# Altium project Dash.PrjPCB
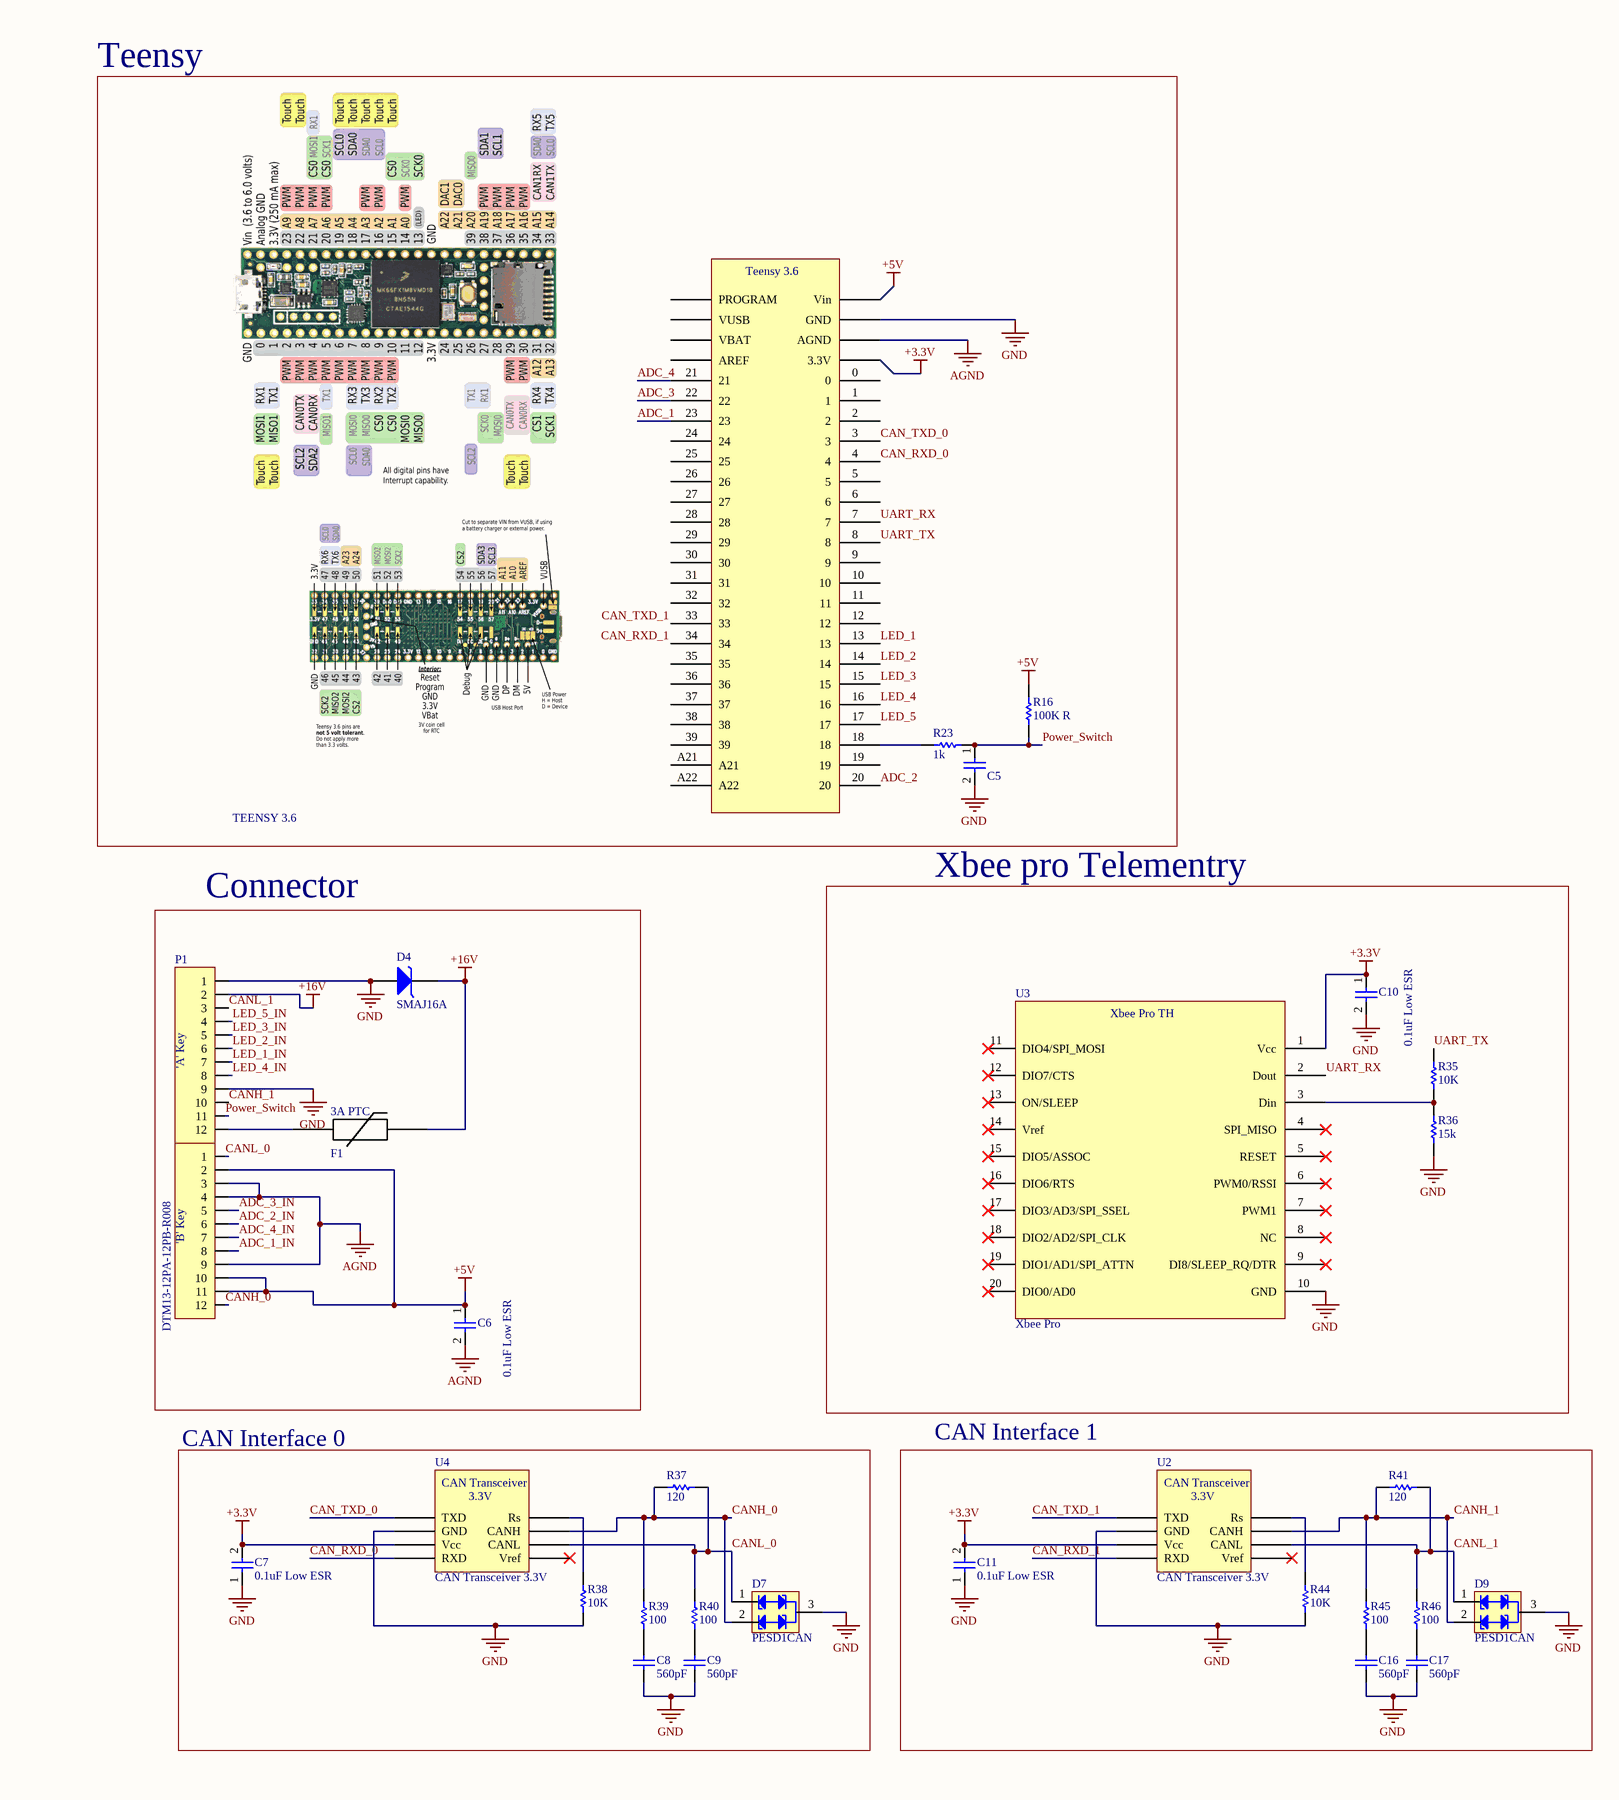
[diagram p0: Dash.SchDoc, left]
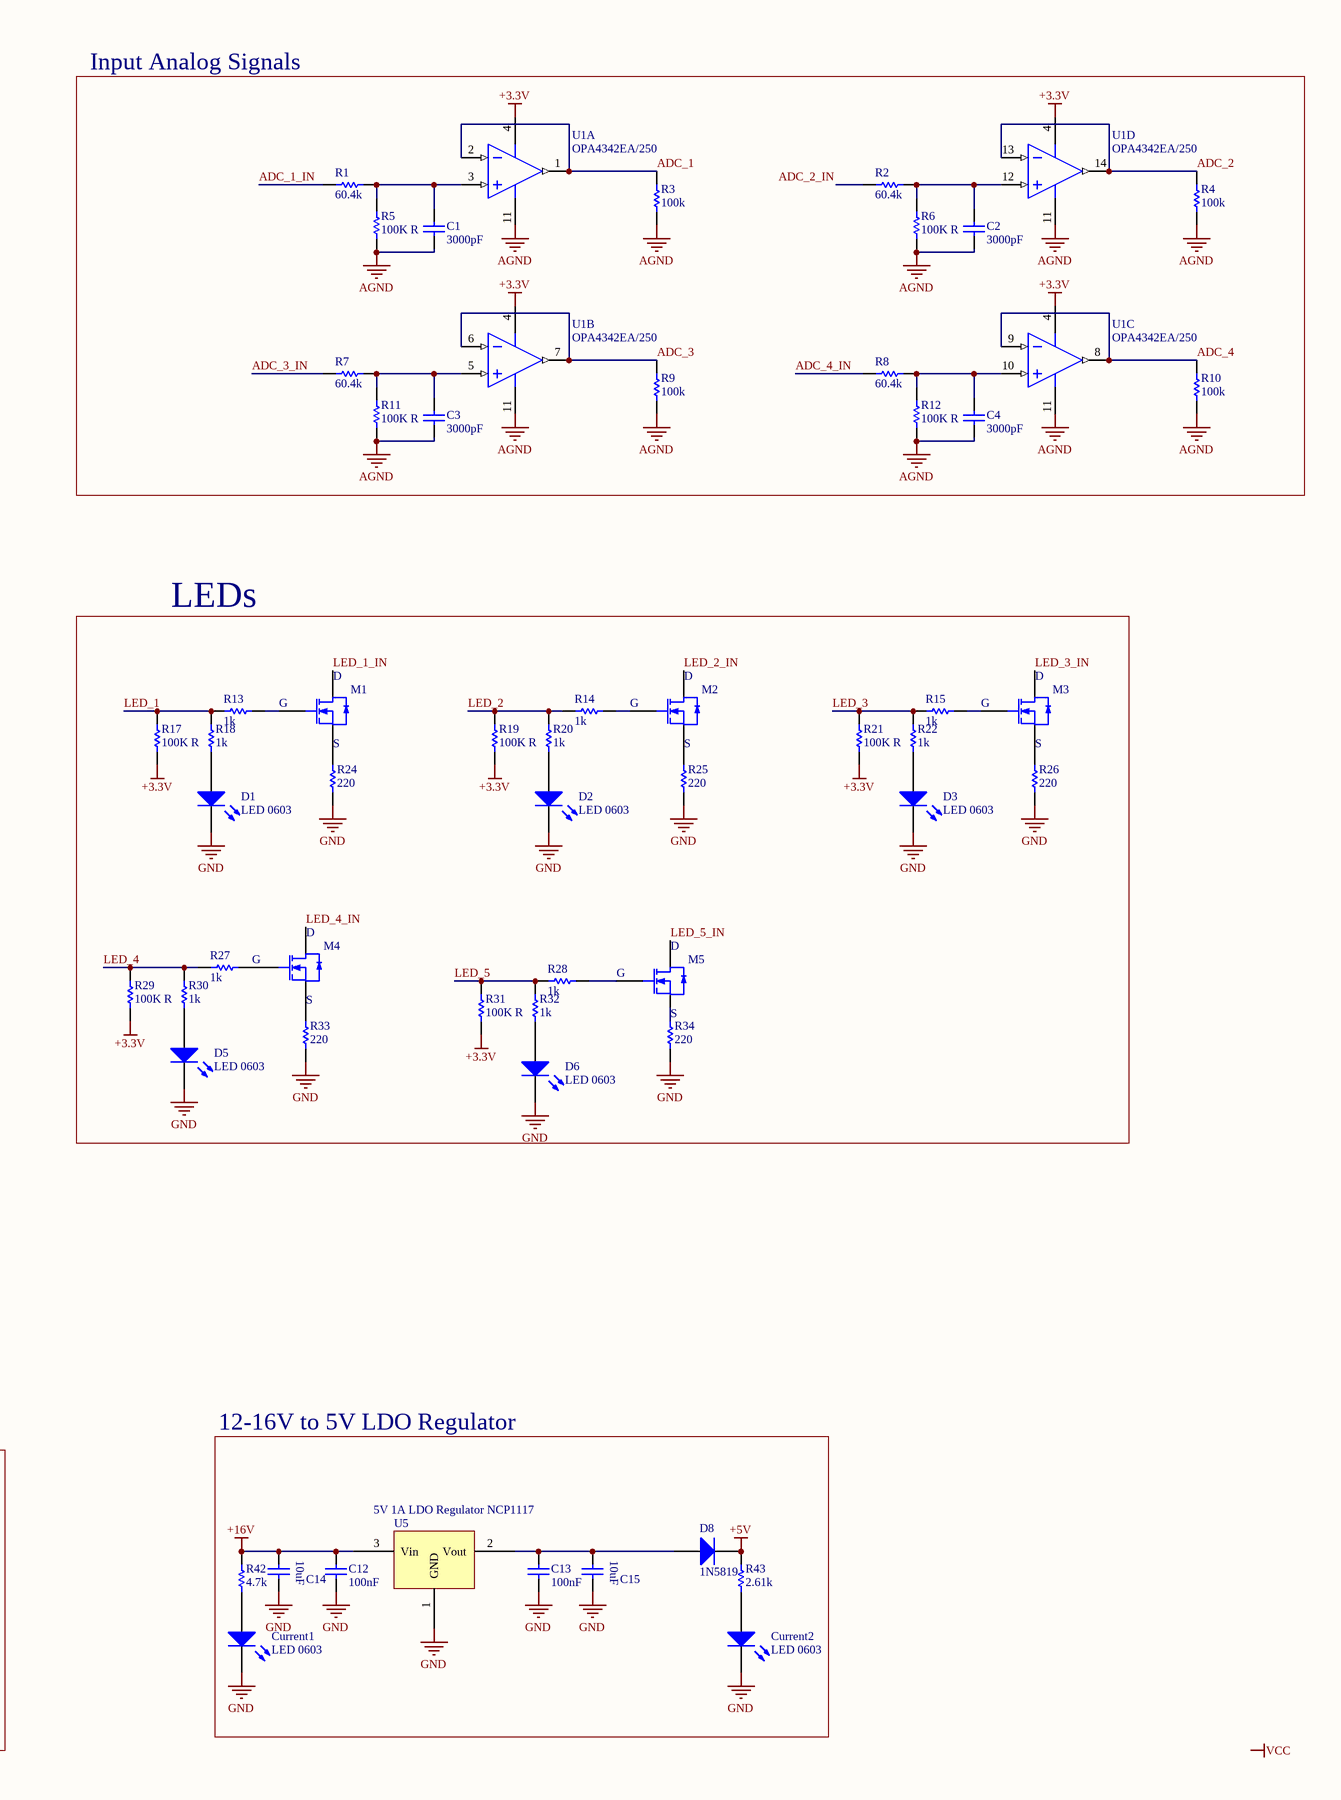
[diagram p1: Dash.SchDoc, right]
1 sheet, 87 parts. Net scope: global (net labels, ports and power ports of the same name join across sheets).
Board file: Dash.PcbDoc

## Sheet Dash.SchDoc
size A2

### Parts
C1  Capacitance: 3000pF  [J1-0603]  (hidden comment: C 3000pF)
C2  Capacitance: 3000pF  [J1-0603]  (hidden comment: C 3000pF)
C3  Capacitance: 3000pF  [J1-0603]  (hidden comment: C 3000pF)
C4  Capacitance: 3000pF  [J1-0603]  (hidden comment: C 3000pF)
C5  0.1uF Low ESR  [J1-0603]  (value not drawn)
C6  0.1uF Low ESR  [J1-0603]
C7  0.1uF Low ESR  [J1-0603]
C8  Capacitance: 560pF  [C0805]  (hidden comment: C 560pF)
C9  Capacitance: 560pF  [C0805]  (hidden comment: C 560pF)
C10  0.1uF Low ESR  [J1-0603]
C11  0.1uF Low ESR  [J1-0603]
C12  Capacitance: 100nF  [J1-0603]  (hidden comment: 0.1uF 0603)
C13  Capacitance: 100nF  [J1-0603]  (hidden comment: 0.1uF 0603)
C14  C 10uF 25V 0805  [C0805]  (value not drawn)
C15  C 10uF 25V 0805  [C0805]  (value not drawn)
C16  Capacitance: 560pF  [C0805]  (hidden comment: C 560pF)
C17  Capacitance: 560pF  [C0805]  (hidden comment: C 560pF)
Current1  LED 0603  [J1-0603 LED]
Current2  LED 0603  [J1-0603 LED]
D1  LED 0603  [J1-0603 LED]
D2  LED 0603  [J1-0603 LED]
D3  LED 0603  [J1-0603 LED]
D4  SMAJ16A  [DO-214AC]
D5  LED 0603  [J1-0603 LED]
D6  LED 0603  [J1-0603 LED]
D7  PESD1CAN  [SOT323(SC-70)]
D8  1N5819  [SOD123]
D9  PESD1CAN  [SOT323(SC-70)]
F1  PTC RESET FUSE 24V 3A 2920  [2920 (7351 Metric)]  (value not drawn)
M1  Mosfet N-Channel 3.3V Switch  [SOT23_N]  (value not drawn)
M2  Mosfet N-Channel 3.3V Switch  [SOT23_N]  (value not drawn)
M3  Mosfet N-Channel 3.3V Switch  [SOT23_N]  (value not drawn)
M4  Mosfet N-Channel 3.3V Switch  [SOT23_N]  (value not drawn)
M5  Mosfet N-Channel 3.3V Switch  [SOT23_N]  (value not drawn)
P1  DTM13-12PA-12PB-R008  [DTM13-12PA-12PB-R008]
R1  Resistance (Ohms): 60.4k  [J1-0603]  (hidden comment: 60.4K R)
R2  Resistance (Ohms): 60.4k  [J1-0603]  (hidden comment: 60.4K R)
R3  Resistance (Ohms): 100k  [J1-0603]  (hidden comment: 100K R)
R4  Resistance (Ohms): 100k  [J1-0603]  (hidden comment: 100K R)
R5  100K R  [J1-0603]
R6  100K R  [J1-0603]
R7  Resistance (Ohms): 60.4k  [J1-0603]  (hidden comment: 60.4K R)
R8  Resistance (Ohms): 60.4k  [J1-0603]  (hidden comment: 60.4K R)
R9  Resistance (Ohms): 100k  [J1-0603]  (hidden comment: 100K R)
R10  Resistance (Ohms): 100k  [J1-0603]  (hidden comment: 100K R)
R11  100K R  [J1-0603]
R12  100K R  [J1-0603]
R13  Resistance (Ohms): 1k  [J1-0603]  (hidden comment: 1K R)
R14  Resistance (Ohms): 1k  [J1-0603]  (hidden comment: 1K R)
R15  Resistance (Ohms): 1k  [J1-0603]  (hidden comment: 1K R)
R16  100K R  [J1-0603]
R17  100K R  [J1-0603]
R18  Resistance (Ohms): 1k  [J1-0603]  (hidden comment: 1K R)
R19  100K R  [J1-0603]
R20  Resistance (Ohms): 1k  [J1-0603]  (hidden comment: 1K R)
R21  100K R  [J1-0603]
R22  Resistance (Ohms): 1k  [J1-0603]  (hidden comment: 1K R)
R23  Resistance (Ohms): 1k  [J1-0603]  (hidden comment: 1K R)
R24  Resistance (Ohms): 220  [J1-0603]  (hidden comment: 220 R)
R25  Resistance (Ohms): 220  [J1-0603]  (hidden comment: 220 R)
R26  Resistance (Ohms): 220  [J1-0603]  (hidden comment: 220 R)
R27  Resistance (Ohms): 1k  [J1-0603]  (hidden comment: 1K R)
R28  Resistance (Ohms): 1k  [J1-0603]  (hidden comment: 1K R)
R29  100K R  [J1-0603]
R30  Resistance (Ohms): 1k  [J1-0603]  (hidden comment: 1K R)
R31  100K R  [J1-0603]
R32  Resistance (Ohms): 1k  [J1-0603]  (hidden comment: 1K R)
R33  Resistance (Ohms): 220  [J1-0603]  (hidden comment: 220 R)
R34  Resistance (Ohms): 220  [J1-0603]  (hidden comment: 220 R)
R35  value 10K  [0603]  (hidden comment: 10K R)
R36  value 15k  [0603]  (hidden comment: 15K R)
R37  Resistance (Ohms): 120  [J1-0603]  (hidden comment: 120 R)
R38  value 10K  [J1-0603]  (hidden comment: 10K R)
R39  Resistance (Ohms): 100  [J1-0603]  (hidden comment: 100 R)
R40  Resistance (Ohms): 100  [J1-0603]  (hidden comment: 100 R)
R41  Resistance (Ohms): 120  [J1-0603]  (hidden comment: 120 R)
R42  Resistance (Ohms): 4.7k  [J1-0603]  (hidden comment: 4.7K R)
R43  Resistance (Ohms): 2.61k  [J1-0603]  (hidden comment: 2.61k R)
R44  value 10K  [J1-0603]  (hidden comment: 10K R)
R45  Resistance (Ohms): 100  [J1-0603]  (hidden comment: 100 R)
R46  Resistance (Ohms): 100  [J1-0603]  (hidden comment: 100 R)
TEENSY_3.6  Teensy 3.6  [Teensy 3.6]  (value not drawn)
U1  OPA4342EA/250  [TSSOP-14]  (parts A,B,C,D of 4)
U2  CAN Transceiver 3.3V  [8-SOIC]
U3  Xbee Pro  [Xbee Pro]
U4  CAN Transceiver 3.3V  [8-SOIC]
U5  5V 1A LDO Regulator NCP1117  [SOT-223]

### Blocks framed on the sheet
Teensy: C5 R16 R23 TEENSY_3.6
Input Analog Signals: C1-C4 R1-R12 U1
LEDs: D1-D3 D5 D6 M1-M5 R13-R15 R17-R22 R24-R34
Connector: C6 D4 F1 P1
Xbee pro Telementry: C10 R35 R36 U3
CAN Interface 0: C7-C9 D7 R37-R40 U4
CAN Interface 1: C11 C16 C17 D9 R41 R44-R46 U2
12-16V to 5V LDO Regulator: C12-C15 Current1 Current2 D8 R42 R43 U5

### Nets
+3.3V: C7.2 C10.1 C11.2 R17.2 R19.2 R21.2 R29.2 R31.2 TEENSY_3.6.3.3V U1.4(V+) U2.3(Vcc) U3.1(Vcc) U4.3(Vcc)
+5V: C6.1 D8.1 P1.14(2) P1.22(10) P1.23(11) R16.1 R43.1 TEENSY_3.6.VIN(Vin)
+16V: C12.2 C14.1 D4.1(K) F1.1 P1.2 R42.1 U5.3(Vin)
AGND: C1.2 C2.2 C3.2 C4.2 C6.2 P1.15(3) P1.16(4) P1.21(9) R3.1 R4.1 R5.2 R6.2 R9.1 R10.1 R11.2 R12.2 TEENSY_3.6.AGND U1.11(V-)
GND: C5.2 C7.1 C8.1 C9.1 C10.2 C11.1 C12.1 C13.1 C14.2 C15.2 C16.1 C17.1 Current1.2(K) Current2.2(K) D1.2(K) D2.2(K) D3.2(K) D4.2(A) D5.2(K) D6.2(K) D7.3 D9.3 P1.1 P1.9 R24.2 R25.2 R26.2 R33.2 R34.2 R36.1 R38.1 R44.1 TEENSY_3.6.GND U2.2(GND) U3.10(GND) U4.2(GND) U5.1(GND)
ADC_1: R3.2 TEENSY_3.6.23 U1.1(OUT_A) U1.2(IN_A-)
ADC_1_IN: P1.20(8) R1.1
ADC_2: R4.2 TEENSY_3.6.20 U1.13(IN_D-) U1.14(OUT_D)
ADC_2_IN: P1.18(6) R2.1
ADC_3: R9.2 TEENSY_3.6.22 U1.6(IN_B-) U1.7(OUT_B)
ADC_3_IN: P1.17(5) R7.1
ADC_4: R10.2 TEENSY_3.6.21 U1.8(OUT_C) U1.9(IN_C-)
ADC_4_IN: P1.19(7) R8.1
CAN_RXD_0: TEENSY_3.6.4 U4.4(RXD)
CAN_RXD_1: TEENSY_3.6.34 U2.4(RXD)
CAN_TXD_0: TEENSY_3.6.3 U4.1(TXD)
CAN_TXD_1: TEENSY_3.6.33 U2.1(TXD)
CANH_0: D7.2 P1.24(12) R37.1 R39.1 U4.7(CANH)
CANH_1: D9.2 P1.10 R41.1 R45.1 U2.7(CANH)
CANL_0: D7.1 P1.13(1) R37.2 R40.2 U4.6(CANL)
CANL_1: D9.1 P1.3 R41.2 R46.2 U2.6(CANL)
LED_1: R13.1 R17.1 R18.2 TEENSY_3.6.13
LED_1_IN: M1.1(D) P1.7
LED_2: R14.1 R19.1 R20.2 TEENSY_3.6.14
LED_2_IN: M2.1(D) P1.6
LED_3: R15.1 R21.1 R22.2 TEENSY_3.6.15
LED_3_IN: M3.1(D) P1.5
LED_4: R27.1 R29.1 R30.2 TEENSY_3.6.16
LED_4_IN: M4.1(D) P1.8
LED_5: R28.1 R31.1 R32.2 TEENSY_3.6.17
LED_5_IN: M5.1(D) P1.4
Power_Switch: C5.1 P1.11 R16.2 R23.2
UART_RX: TEENSY_3.6.7 U3.2(Dout)
UART_TX: R35.2 TEENSY_3.6.8
NetC1_1: C1.1 R1.2 R5.1 U1.3(IN_A+)
NetC2_1: C2.1 R2.2 R6.1 U1.12(IN_D+)
NetC3_1: C3.1 R7.2 R11.1 U1.5(IN_B+)
NetC4_1: C4.1 R8.2 R12.1 U1.10(IN_C+)
NetC8_2: C8.2 R39.2
NetC9_2: C9.2 R40.1
NetC13_2: C13.2 C15.1 D8.2 U5.2(Vout)
NetC16_2: C16.2 R45.2
NetC17_2: C17.2 R46.1
NetCurrent1_1: Current1.1(A) R42.2
NetCurrent2_1: Current2.1(A) R43.2
NetD1_1: D1.1(A) R18.1
NetD2_1: D2.1(A) R20.1
NetD3_1: D3.1(A) R22.1
NetD5_1: D5.1(A) R30.1
NetD6_1: D6.1(A) R32.1
NetF1_2: F1.2 P1.12
NetM1_2: M1.2(S) R24.1
NetM1_3: M1.3(G) R13.2
NetM2_2: M2.2(S) R25.1
NetM2_3: M2.3(G) R14.2
NetM3_2: M3.2(S) R26.1
NetM3_3: M3.3(G) R15.2
NetM4_2: M4.2(S) R33.1
NetM4_3: M4.3(G) R27.2
NetM5_2: M5.2(S) R34.1
NetM5_3: M5.3(G) R28.2
NetR23_1: R23.1 TEENSY_3.6.18
NetR35_1: R35.1 R36.2 U3.3(Din)
NetR38_2: R38.2 U4.8(Rs)
NetR44_2: R44.2 U2.8(Rs)

Not connected (* = marked no-connect by the designer): TEENSY_3.6 0 1 2 5 6 9 10 11 12 19 24 25 26 27 28 29 30 31 32 35 36 37 38 39 A21 A22 AREF PROGRAM VBAT VUSB; U2 5(Vref)*; U3 4(SPI_MISO)* 5(RESET)* 6(PWM0/RSSI)* 7(PWM1)* 8(NC)* 9(DI8/SLEEP_RQ/DTR)* 11(DIO4/SPI_MOSI)* 12(DIO7/CTS)* 13(ON/SLEEP)* 14(Vref)* 15(DIO5/ASSOC)* 16(DIO6/RTS)* 17(DIO3/AD3/SPI_SSEL)* 18(DIO2/AD2/SPI_CLK)* 19(DIO1/AD1/SPI_ATTN)* 20(DIO0/AD0)*; U4 5(Vref)*

### Notes on the sheet
- Labels drawn without touching a wire or pin: VCC
- (in symbol C 10uF 25V 0805) 10uF
- (in symbol CAN Transceiver 3.3V) CAN Transceiver; 3.3V
- (in symbol DTM13-12PA-12PB-R008) 'A' Key; 'B' Key
- (in symbol PTC RESET FUSE 24V 3A 2920) 3A PTC
- (in symbol Xbee Pro) Xbee Pro TH

### Library data of the parts
C1-C4 = C 3000pF 0603 50V: 0603 Ceramic Capacitor; Manufacturer: Murata Electronics North America; Manufacturer Part Number: GRM1885C1H302JA01D; Tolerance: ±5%; Voltage - Rated: 50V; Temperature Coefficient: C0G, NP0; Supplier 1: Digi-Key; RoHS: RoHS Compliant; Category: Capacitors; Stock 1: 84271; Pricing 1: 1=0.28, 10=0.201, 100=0.0945, 1000=0.05483 (AUD); Packaging: Cut Tape (CT); Part Status: Active; Operating Temperature: -55°C ~ 125°C; Features: -; Ratings: -; Applications: General Purpose; Mounting Type: Surface Mount, MLCC; Package / Case: 0603 (1608 Metric); Size / Dimension: 0.063" L x 0.031" W (1.60mm x 0.80mm); Height - Seated (Max): -; Thickness (Max): 0.035" (0.90mm); Lead Spacing: -; Lead Style: -; ComponentLink1URL: http://www.murata.com/~/media/webrenewal/support/library/catalog/products/capacitor/mlcc/c02e.ashx; ComponentLink1Description: http://www.murata.com/~/media/webrenewal/support/library/catalog/products/capacitor/mlcc/c02e.ashx; Supplier Part Number 1: 490-6384-1-ND
C5-C7 C10 C11 = C0.1uF  Low ESR 0603 250V: CAP CER 0.1UF 100V 10% X7R 0603; Manufacturer: AVX Corporation; Manufacturer Part Number: 06031U101GAT2A; Capacitance: 100pF; Tolerance: ±2%; Temperature Coefficient: C0G, NP0; Supplier 1: Digi-Key; RoHS: RoHS Compliant; Category: Capacitors; Stock 1: 16000; Pricing 1: 1=0.49, 10=0.337, 100=0.2025, 500=0.15186, 1000=0.12823 (AUD); Packaging: Cut Tape (CT); Part Status: Active; Voltage - Rated: 100V; Operating Temperature: -55°C ~ 125°C; Features: Ultra-Low ESR; Ratings: -; Applications: RF, Microwave, High Frequency; Mounting Type: Surface Mount, MLCC; Package / Case: 0603 (1608 Metric); Size / Dimension: 0.060" L x 0.030" W (1.52mm x 0.76mm); Height - Seated (Max): -; Thickness (Max): 0.036" (0.91mm); Lead Spacing: -; Lead Style: -; ComponentLink1URL: http://datasheets.avx.com/AutoU_Series.pdf; ComponentLink1Description: http://datasheets.avx.com/AutoU_Series.pdf; Supplier Part Number 1: 478-10231-1-ND
C8 C9 C16 C17 = C 560pF 0805 50V: 0805 Ceramic Capacitor; Manufacturer: KEMET; Manufacturer Part Number: C0805C561K5RACTU; Tolerance: ±10%; Voltage - Rated: 50V; Temperature Coefficient: X7R; Supplier 1: Digi-Key; RoHS: RoHS Compliant; Category: Capacitors; Stock 1: 51668; Pricing 1: 1=0.35, 10=0.247, 25=0.1972, 50=0.1646, 100=0.1398, 250=0.11108, 500=0.09872, 1000=0.08636 (AUD); Packaging: Cut Tape (CT); Part Status: Active; Operating Temperature: -55°C ~ 125°C; Features: Low ESL; Ratings: -; Applications: General Purpose; Failure Rate: -; Mounting Type: Surface Mount, MLCC; Package / Case: 0805 (2012 Metric); Size / Dimension: 0.079" L x 0.049" W (2.00mm x 1.25mm); Height - Seated (Max): -; Thickness (Max): 0.035" (0.88mm); Lead Spacing: -; Lead Style: -; ComponentLink1URL: http://www.kemet.com/docfinder?Partnumber=C0805C561K5RACTU; ComponentLink1Description: http://www.kemet.com/docfinder?Partnumber=C0805C561K5RACTU; Supplier Part Number 1: 399-1143-1-ND
C12 C13 = C 0.1uF 0603 50V: CAP CER 0.1UF 50V X8L 0603; Manufacturer: Murata; Manufacturer Part Number: GCM188L81H104KA57D; Tolerance: 10%; ComponentLink1URL: https://datasheet.ciiva.com/5999/1725424-5999395.pdf; ComponentLink1Description: https://datasheet.ciiva.com/5999/1725424-5999395.pdf; ComponentLink2URL: https://datasheet.ciiva.com/7823/1725424-7823589.pdf; ComponentLink2Description: https://datasheet.ciiva.com/7823/1725424-7823589.pdf; ComponentLink3URL: https://datasheet.ciiva.com/14589/70095383-14589014.pdf; ComponentLink3Description: https://datasheet.ciiva.com/14589/70095383-14589014.pdf; ComponentLink4URL: https://datasheet.ciiva.com/22749/kem-c1002-x7r-smd-22749657.pdf; ComponentLink4Description: https://datasheet.ciiva.com/22749/kem-c1002-x7r-smd-22749657.pdf; ComponentLink5URL: https://datasheet.ciiva.com/5413/kem-c1002-x7r-smd-5413791.pdf; ComponentLink5Description: https://datasheet.ciiva.com/5413/kem-c1002-x7r-smd-5413791.pdf; ComponentLink6URL: http://www.kemet.com/docfinder?Partnumber=C0603C104K4RACTU; ComponentLink6Description: http://www.kemet.com/docfinder?Partnumber=C0603C104K4RACTU; Supplier 1: Digi-Key; Stock 1: 175; Pricing 1: 1=0.19, 10=0.133, 100=0.0624, 500=0.04378, 1000=0.03624 (USD); Mount: Surface Mount; Case/Package: 0603; Case Code (Metric): 1608; Case Code (Imperial): 0603; Min Operating Temperature: -55°C; Max Operating Temperature: 150°C; Packaging: Tape and Reel; Voltage Rating: 50V; Voltage Rating (DC): 50V; Package Quantity: 4000; Dielectric: X8L; Termination: SMD/SMT; Voltage: 50V; Length: 1.6mm; Height: 0.8mm; Width: 0.5mm; Thickness: 0.035inch; Depth: 0.8mm; Radiation Hardening: No; Lead Free: Lead Free; ComponentLink7URL: https://datasheet.ciiva.com/6277/s0717e-6277799.pdf; ComponentLink7Description: https://datasheet.ciiva.com/6277/s0717e-6277799.pdf; ComponentLink8URL: https://datasheet.ciiva.com/6277/s0717e-6277800.pdf; ComponentLink8Description: https://datasheet.ciiva.com/6277/s0717e-6277800.pdf; ComponentLink9URL: https://datasheet.ciiva.com/6277/s0717e-6277801.pdf; ComponentLink9Description: https://datasheet.ciiva.com/6277/s0717e-6277801.pdf; Supplier Part Number 1: 490-6049-6-ND
C14 C15 = C 10uF 25V 0805: CAP CER 10UF 25V X5R 0805; Manufacturer: Samsung Electro-Mechanics America, Inc.; Manufacturer Part Number: CL21A106KAFN3NE; Capacitance: 10µF; Tolerance: ±10%; Category: Capacitors; Packaging: Cut Tape (CT); Voltage - Rated: 25V; Temperature Coefficient: X5R; Mounting Type: Surface Mount, MLCC; Operating Temperature: -55°C ~ 85°C; Applications: General Purpose; Ratings: -; Package / Case: 0805 (2012 Metric); Size / Dimension: 0.079" L x 0.049" W (2.00mm x 1.25mm); Height - Seated (Max): -; Thickness (Max): 0.053" (1.35mm); Lead Spacing: -; Features: -; Lead Style: -; ComponentLink1URL: http://media.digikey.com/pdf/Data%20Sheets/Samsung%20PDFs/CL_Series_MLCC_ds.pdf; ComponentLink1Description: http://media.digikey.com/pdf/Data%20Sheets/Samsung%20PDFs/CL_Series_MLCC_ds.pdf; Supplier 1: Digi-Key; RoHS: RoHS Compliant; Stock 1: 116435; Pricing 1: 1=0.31, 10=0.209, 100=0.1056, 500=0.07228, 1000=0.06394 (AUD); Part Status: Active; Supplier Part Number 1: 1276-2891-1-ND
Current1 Current2 = LED 0603: Typical INFRARED GaAs LED; Manufacturer: Dialight; Manufacturer Part Number: 5988010107F; Wavelength - Dominant: 635nm; Millicandela Rating: 60mcd; Voltage - Forward (Vf) (Typ): 2V; Current - Test: 20mA; Viewing Angle: 140°; Lens Transparency: Clear; Lens Color: Colorless; Lens Style/Size: Rectangle with Flat Top, 1.10mm x 0.80mm; Published: 8-Jun-2000; LatestRevisionDate: 08-Jul-2005; LatestRevisionNote: Mech Layer 1 removed.; PackageReference: LED-0; Publisher: Altium Limited; PackageDescription: LED; 2 Leads; Supplier 1: Digi-Key; RoHS: RoHS Compliant; Category: Optoelectronics; Stock 1: 134; Pricing 1: 1=0.6, 10=0.461, 100=0.3308, 250=0.2954, 500=0.25404, 1000=0.19613, 2500=0.17722, 5000=0.1668 (AUD); Packaging: Cut Strip; Color: Red; Wavelength - Peak: -; Package / Case: 0603 (1608 Metric); Supplier Device Package: *; Size / Dimension: 1.60mm L x 0.80mm W; Height (Max): 0.70mm; Mounting Type: Surface Mount; ComponentLink1URL: http://media.digikey.com/pdf/Data%20Sheets/Dialight%20PDFs/598_Series_0603_Pkg.pdf; ComponentLink1Description: http://media.digikey.com/pdf/Data%20Sheets/Dialight%20PDFs/598_Series_0603_Pkg.pdf; Supplier Part Number 1: 350-2029-1-ND
D1-D3 D5 D6 = LED 0603: Typical INFRARED GaAs LED; Manufacturer: Dialight; Manufacturer Part Number: 5988010107F; Color: Red; Wavelength - Dominant: 635nm; Millicandela Rating: 60mcd; Voltage - Forward (Vf) (Typ): 2V; Current - Test: 20mA; Viewing Angle: 140°; Lens Transparency: Clear; Lens Color: Colorless; Lens Style/Size: Rectangle with Flat Top, 1.10mm x 0.80mm; Published: 8-Jun-2000; LatestRevisionDate: 08-Jul-2005; LatestRevisionNote: Mech Layer 1 removed.; PackageReference: LED-0; Publisher: Altium Limited; PackageDescription: LED; 2 Leads; Supplier 1: Digi-Key; RoHS: RoHS Compliant; Category: Optoelectronics; Stock 1: 134; Pricing 1: 1=0.6, 10=0.461, 100=0.3308, 250=0.2954, 500=0.25404, 1000=0.19613, 2500=0.17722, 5000=0.1668 (AUD); Packaging: Cut Strip; Wavelength - Peak: -; Package / Case: 0603 (1608 Metric); Supplier Device Package: *; Size / Dimension: 1.60mm L x 0.80mm W; Height (Max): 0.70mm; Mounting Type: Surface Mount; ComponentLink1URL: http://media.digikey.com/pdf/Data%20Sheets/Dialight%20PDFs/598_Series_0603_Pkg.pdf; ComponentLink1Description: http://media.digikey.com/pdf/Data%20Sheets/Dialight%20PDFs/598_Series_0603_Pkg.pdf; Supplier Part Number 1: 350-2029-1-ND
D4 = SMAJ16A: TVS DIODE 16VWM 26VC SMA; Manufacturer: Littelfuse; Breakdown Voltage-Max: 19.7 V; Breakdown Voltage-Min: 17.8 V; Clamping Voltage-Max: 26 V; Power Dissipation: 400 W; Directional: Uni-Directional; Type: Zener; Unidirectional Channels: 1; Voltage - Reverse Standoff (Typ): 16V; Voltage - Breakdown (Min): 17.8V; Voltage - Clamping (Max) @ Ipp: 26V; Current - Peak Pulse (10/1000µs): 15.4A; Power - Peak Pulse: 400W; Power Line Protection: No; Manufacturer Part Number: SMAJ16A; ComponentLink1URL: https://datasheet.ciiva.com/340/littelfuse-tvs-diode-smaj-datasheet-pdf-340499.pdf; ComponentLink1Description: https://datasheet.ciiva.com/340/littelfuse-tvs-diode-smaj-datasheet-pdf-340499.pdf; ComponentLink2URL: https://datasheet.ciiva.com/340/littelfuse-tvs-diode-smaj-datasheet-pdf-340500.pdf; ComponentLink2Description: https://datasheet.ciiva.com/340/littelfuse-tvs-diode-smaj-datasheet-pdf-340500.pdf; ComponentLink3URL: https://datasheet.ciiva.com/340/littelfuse-tvs-diode-smaj-datasheet-pdf-340501.pdf; ComponentLink3Description: https://datasheet.ciiva.com/340/littelfuse-tvs-diode-smaj-datasheet-pdf-340501.pdf; ComponentLink4URL: https://datasheet.ciiva.com/16212/littelfuse-tvs-diode-smaj-16212775.pdf; ComponentLink4Description: https://datasheet.ciiva.com/16212/littelfuse-tvs-diode-smaj-16212775.pdf; ComponentLink5URL: https://datasheet.ciiva.com/4508/littelfuse-tvs-diode-smaj-23503-4508106.pdf; ComponentLink5Description: https://datasheet.ciiva.com/4508/littelfuse-tvs-diode-smaj-23503-4508106.pdf; Supplier 1: Digi-Key; RoHS: RoHS Compliant; Category: Circuit Protection; Stock 1: 34991; Pricing 1: 1=0.56, 10=0.433, 25=0.3656, 100=0.2978, 250=0.24672, 500=0.2042, 1000=0.15314, 2500=0.14038 (AUD); Packaging: Cut Tape (CT); Part Status: Active; Bidirectional Channels: -; Applications: General Purpose; Capacitance @ Frequency: -; Operating Temperature: -55°C ~ 150°C (TJ); Mounting Type: Surface Mount; Package / Case: DO-214AC, SMA; Supplier Device Package: DO-214AC (SMA); ComponentLink6URL: http://www.littelfuse.com/~/media/electronics/datasheets/tvs_diodes/littelfuse_tvs_diode_smaj_datasheet.pdf.pdf; ComponentLink6Description: http://www.littelfuse.com/~/media/electronics/datasheets/tvs_diodes/littelfuse_tvs_diode_smaj_datasheet.pdf.pdf; Supplier Part Number 1: SMAJ16ALFCT-ND
D7 D9 = PESD1CAN: Manufacturer: Nexperia USA Inc.; Manufacturer Part Number: PESD1CAN-UX; Type: Zener; Voltage - Reverse Standoff (Typ): 24V (Max); Voltage - Breakdown (Min): 25.4V; Voltage - Clamping (Max) @ Ipp: 50V; Current - Peak Pulse (10/1000µs): 3A (8/20µs); Power - Peak Pulse: 150W; Power Line Protection: No; Capacitance @ Frequency: 9.3pF @ 1MHz; Supplier 1: Digi-Key; RoHS: RoHS Compliant; Category: Circuit Protection; Stock 1: 61695; Pricing 1: 1=0.49, 10=0.402, 100=0.274, 500=0.20544, 1000=0.15407 (AUD); Packaging: Cut Tape (CT); Part Status: Active; Applications: CAN; Operating Temperature: -55°C ~ 150°C (TA); Mounting Type: Surface Mount; Package / Case: SC-70, SOT-323; Supplier Device Package: SOT-323-3; ComponentLink1URL: http://assets.nexperia.com/documents/data-sheet/PESD1CAN-U.pdf; ComponentLink1Description: http://assets.nexperia.com/documents/data-sheet/PESD1CAN-U.pdf; Supplier Part Number 1: 1727-1306-1-ND
D8 = Diode 1N5819: Schottky Barrier Rectifier; Manufacturer: Diodes Incorporated; Manufacturer Part Number: 1N5819HW-7-F; Voltage - DC Reverse (Vr) (Max): 40V; Current - Average Rectified (Io): 1A; Voltage - Forward (Vf) (Max) @ If: 450mV @ 1A; Speed: Fast Recovery =< 500ns, > 200mA (Io); Current - Reverse Leakage @ Vr: 1mA @ 40V; Capacitance @ Vr, F: 60pF @ 4V, 1MHz; Supplier 1: Digi-Key; RoHS: RoHS Compliant; Category: Discrete Semiconductor Products; Stock 1: 76491; Pricing 1: 1=0.64, 10=0.471, 100=0.267, 500=0.17682, 1000=0.13556 (AUD); Packaging: Cut Tape (CT); Part Status: Active; Diode Type: Schottky; Reverse Recovery Time (trr): -; Mounting Type: Surface Mount; Package / Case: SOD-123; Supplier Device Package: SOD-123; Operating Temperature - Junction: -65°C ~ 125°C; ComponentLink1URL: http://www.diodes.com/assets/Datasheets/ds30217.pdf; ComponentLink1Description: http://www.diodes.com/assets/Datasheets/ds30217.pdf; Supplier Part Number 1: 1N5819HW-FDICT-ND
F1 = PTC RESET FUSE 24V 3A 2920: Manufacturer: Bourns Inc.; Manufacturer Part Number: MF-LSMF300/24X-2; Type: Polymeric; Approvals: cURus, TUV; Supplier 1: Digi-Key; RoHS: RoHS Compliant; Category: Circuit Protection; Stock 1: 136194; Pricing 1: 1=1.24, 5=1.196, 10=1.12, 50=0.9266, 100=0.7722, 250=0.75288, 500=0.63708, 1000=0.55985 (AUD); Packaging: Cut Tape (CT); Part Status: Active; Voltage - Max: 24V; Operating Temperature: -40°C ~ 85°C; Ratings: AEC-Q200; Mounting Type: Surface Mount; Package / Case: 2920 (7351 Metric), Concave; Size / Dimension: 0.289" L x 0.202" W (7.36mm x 5.12mm); Height - Seated (Max): -; Thickness (Max): 0.063" (1.60mm); Lead Spacing: -; ComponentLink1URL: http://www.bourns.com/docs/Product-Datasheets/mflsmf.pdf; ComponentLink1Description: http://www.bourns.com/docs/Product-Datasheets/mflsmf.pdf; Supplier Part Number 1: MF-LSMF300/24X-2CT-ND
M1-M5 = Mosfet IRLML6244TRPBFCT-ND: MOSFET N-CH 30V 5A SOT23; Manufacturer: Infineon Technologies; Current - Continuous Drain (Id) @ 25°C: 6.3A (Ta); Drive Voltage (Max Rds On,  Min Rds On): 2.5V, 4.5V; Rds On (Max) @ Id, Vgs: 21 mOhm @ 6.3A, 4.5V; Vgs(th) (Max) @ Id: 1.1V @ 10µA; Vgs (Max): ±12V; Power Dissipation (Max): 1.3W (Ta); Supplier 1: Digi-Key; Manufacturer Part Number: IRLML6244TRPBF; RoHS: RoHS Compliant; Category: Discrete Semiconductor Products; Stock 1: 29388; Pricing 1: 1=0.74, 10=0.585, 100=0.4017, 500=0.2754, 1000=0.20654 (AUD); Packaging: Cut Tape (CT); Part Status: Active; FET Type: N-Channel; Technology: MOSFET (Metal Oxide); FET Feature: -; Operating Temperature: -55°C ~ 150°C (TJ); Mounting Type: Surface Mount; Supplier Device Package: Micro3™/SOT-23; Package / Case: TO-236-3, SC-59, SOT-23-3; ComponentLink1URL: https://www.infineon.com/dgdl/irlml6244pbf.pdf?fileId=5546d462533600a4015356686fed261f; ComponentLink1Description: https://www.infineon.com/dgdl/irlml6244pbf.pdf?fileId=5546d462533600a4015356686fed261f; Supplier Part Number 1: IRLML6244TRPBFCT-ND
P1 = DTM13-12PA-12PB-R008: Manufacturer: TE Connectivity Deutsch Connectors; Connector Type: Header; Number of Positions: 24 (12 + 12); Number of Positions Loaded: All; Style: Board to Cable/Wire; Shrouding: Shrouded - 4 Wall; Contact Length - Post: 0.112" (2.84mm); Ingress Protection: IP68/IP6K9K; Supplier 1: Digi-Key; RoHS: RoHS Compliant; Category: Connectors, Interconnects; Stock 1: 3139; Pricing 1: 1=30.07, 10=27.152, 25=26.0132, 50=24.3874, 100=23.5746, 250=22.27388, 500=21.62356 (AUD); Packaging: Bulk; Part Status: Active; Contact Type: Male Pin; Pitch - Mating: -; Number of Rows: 2; Row Spacing - Mating: -; Mounting Type: Panel Mount, Through Hole, Right Angle; Termination: Solder; Fastening Type: Latch Holder; Contact Length - Mating: -; Overall Contact Length: -; Insulation Height: 1.378" (35.00mm); Contact Shape: Circular; Contact Finish - Mating: Nickel; Contact Finish Thickness - Mating: -; Contact Finish - Post: Tin; Contact Material: -; Insulation Material: Plastic; Features: Mounting Flange; Operating Temperature: -; Material Flammability Rating: -; Insulation Color: Gray; Current Rating: -; Voltage Rating: -; Mated Stacking Heights: -; Contact Finish Thickness - Post: -; Applications: Automotive; ComponentLink1URL: http://www.te.com/commerce/DocumentDelivery/DDEController?Action=srchrtrv&DocNm=DTM13-12PX-12PX-R008&DocType=Customer+Drawing&DocLang=English; ComponentLink1Description: http://www.te.com/commerce/DocumentDelivery/DDEController?Action=srchrtrv&DocNm=DTM13-12PX-12PX-R008&DocType=Customer+Drawing&DocLang=English; Supplier Part Number 1: 1734-1131-ND; Manufacturer Part Number: DTM13-12PA-12PB-R008
R1 R2 R7 R8 = R60.4k_0603: 60.4k Resistor 0603; Manufacturer: Yageo; Manufacturer Part Number: RC0603FR-0760K4L; Tolerance: ±1%; Power (Watts): 0.1W, 1/10W; Temperature Coefficient: ±100ppm/°C; Supplier 1: Digi-Key; RoHS: RoHS Compliant; Category: Resistors; Stock 1: 319012; Pricing 1: 1=0.15, 10=0.022, 100=0.009, 1000=0.00403, 2500=0.0035 (AUD); Packaging: Cut Tape (CT); Part Status: Active; Composition: Thick Film; Features: Moisture Resistant; Operating Temperature: -55°C ~ 155°C; Package / Case: 0603 (1608 Metric); Supplier Device Package: 0603; Size / Dimension: 0.063" L x 0.031" W (1.60mm x 0.80mm); Height - Seated (Max): 0.022" (0.55mm); Failure Rate: -; ComponentLink1URL: http://www.yageo.com/documents/recent/PYu-RC_Group_51_RoHS_L_7.pdf; ComponentLink1Description: http://www.yageo.com/documents/recent/PYu-RC_Group_51_RoHS_L_7.pdf; Supplier Part Number 1: 311-60.4KHRCT-ND
R3-R6 R9-R12 R16 R17 R19 R21 R29 R31 = R100k_0603: 100k Resistor 0603; Manufacturer: Yageo; Manufacturer Part Number: RC0402FR-07100KL; Tolerance: ±1%; Power (Watts): 0.063W, 1/16W; Temperature Coefficient: ±100ppm/°C; Supplier 1: Digi-Key; RoHS: RoHS Compliant; Category: Resistors; Stock 1: 7264033; Pricing 1: 1=0.15, 10=0.019, 100=0.008, 1000=0.00358, 2500=0.00311, 5000=0.00257 (AUD); Packaging: Cut Tape (CT); Part Status: Active; Composition: Thick Film; Features: Moisture Resistant; Operating Temperature: -55°C ~ 155°C; Package / Case: 0402 (1005 Metric); Supplier Device Package: 0402; Size / Dimension: 0.039" L x 0.020" W (1.00mm x 0.50mm); Height - Seated (Max): 0.016" (0.40mm); Failure Rate: -; ComponentLink1URL: http://www.yageo.com/documents/recent/PYu-RC_Group_51_RoHS_L_7.pdf; ComponentLink1Description: http://www.yageo.com/documents/recent/PYu-RC_Group_51_RoHS_L_7.pdf; Supplier Part Number 1: 311-100KLRCT-ND
  R5 R6 R11 R12 R16 R17 R19 R21 R29 R31: Resistance (Ohms): 100k
R13-R15 R18 R20 R22 R23 R27 R28 R30 R32 = R1k_0603: 1k Resistor 0603; Manufacturer: Yageo; Manufacturer Part Number: RC0603FR-071KL; Tolerance: ±1%; Power (Watts): 0.1W, 1/10W; Temperature Coefficient: ±100ppm/°C; Supplier 1: Digi-Key; RoHS: RoHS Compliant; Category: Resistors; Stock 1: 11536947; Pricing 1: 1=0.15, 10=0.022, 100=0.009, 1000=0.00403, 2500=0.0035 (AUD); Packaging: Cut Tape (CT); Part Status: Active; Composition: Thick Film; Features: Moisture Resistant; Operating Temperature: -55°C ~ 155°C; Package / Case: 0603 (1608 Metric); Supplier Device Package: 0603; Size / Dimension: 0.063" L x 0.031" W (1.60mm x 0.80mm); Height - Seated (Max): 0.022" (0.55mm); Failure Rate: -; ComponentLink1URL: http://www.yageo.com/documents/recent/PYu-RC_Group_51_RoHS_L_7.pdf; ComponentLink1Description: http://www.yageo.com/documents/recent/PYu-RC_Group_51_RoHS_L_7.pdf; Supplier Part Number 1: 311-1.00KHRCT-ND
R24-R26 R33 R34 = R220_0603: 220 Resistor 0603; Manufacturer: TE Connectivity Passive Product; Tolerance: ±1%; Power (Watts): 0.1W, 1/10W; Temperature Coefficient: ±100ppm/°C; Supplier 1: Digi-Key; RoHS: RoHS Compliant; Category: Resistors; Packaging: Cut Tape (CT); Part Status: Active; Composition: Thick Film; Features: Moisture Resistant; Operating Temperature: -55°C ~ 155°C; Package / Case: 0603 (1608 Metric); Supplier Device Package: 0603; Size / Dimension: 0.063" L x 0.031" W (1.60mm x 0.80mm); Height - Seated (Max): 0.022" (0.55mm); Failure Rate: -; Supplier Part Number 1: A130087TR-ND; ComponentLink1Description: https://www.digikey.com.au/product-detail/en/te-connectivity-passive-product/CRGCQ0603J220R/A130087CT-ND/8577919; ComponentLink1URL: https://www.digikey.com.au/product-detail/en/te-connectivity-passive-product/CRGCQ0603J220R/A130087CT-ND/8577919
R35 R38 R44 = R10k_0603: 10k Resistor 0603; Manufacturer: Panasonic Electronic Components; Manufacturer Part Number: ERJ-3EKF1002V; Tolerance: ±1%; Power (Watts): 0.1W, 1/10W; Temperature Coefficient: ±100ppm/°C; Published: 8-Jun-2000; LatestRevisionDate: 17-Jul-2002; LatestRevisionNote: Re-released for DXP Platform.; PackageReference: AXIAL-0.3; Publisher: Altium Limited; PackageDescription: Axial Device, Thru-Hole; 2 Leads; 0.3 in Pin Spacing; Supplier 1: Digi-Key; RoHS: RoHS Compliant; Category: Resistors; Stock 1: 10895920; Pricing 1: 1=0.15, 50=0.0166, 100=0.0122, 250=0.00936, 500=0.00748, 1000=0.00552 (AUD); Packaging: Cut Tape (CT); Resistance (Ohms): 10k; Composition: Thick Film; Features: Automotive AEC-Q200; Operating Temperature: -55°C ~ 155°C; Package / Case: 0603 (1608 Metric); Supplier Device Package: 0603; Size / Dimension: 0.063" L x 0.031" W (1.60mm x 0.80mm); Height: 0.022" (0.55mm); Number of Terminations: 2; ComponentLink1URL: http://industrial.panasonic.com/www-cgi/jvcr13pz.cgi?E+PZ+3+AOA0002+ERJ3EKF1002V+7+WW; ComponentLink1Description: http://industrial.panasonic.com/www-cgi/jvcr13pz.cgi?E+PZ+3+AOA0002+ERJ3EKF1002V+7+WW; Supplier Part Number 1: P10.0KHCT-ND
R36 = R15k_0603: 15k Resistor 0603; Manufacturer: Yageo; Manufacturer Part Number: RC0603FR-0715KL; Tolerance: ±1%; Power (Watts): 0.1W, 1/10W; Temperature Coefficient: ±100ppm/°C; Supplier 1: Digi-Key; RoHS: RoHS Compliant; Category: Resistors; Stock 1: 2420880; Pricing 1: 1=0.14, 10=0.021, 100=0.0084, 1000=0.00376, 2500=0.00326 (AUD); Packaging: Cut Tape (CT); Part Status: Active; Composition: Thick Film; Features: Moisture Resistant; Operating Temperature: -55°C ~ 155°C; Package / Case: 0603 (1608 Metric); Supplier Device Package: 0603; Size / Dimension: 0.063" L x 0.032" W (1.60mm x 0.80mm); Height - Seated (Max): 0.022" (0.55mm); Failure Rate: -; ComponentLink1URL: http://www.yageo.com/documents/recent/PYu-RC_Group_51_RoHS_L_7.pdf; ComponentLink1Description: http://www.yageo.com/documents/recent/PYu-RC_Group_51_RoHS_L_7.pdf; Supplier Part Number 1: 311-15.0KHRCT-ND
R37 R41 = R120_0603: 120 Resistor 0603; Manufacturer: Yageo; Manufacturer Part Number: RC0603FR-07120RL; Tolerance: ±1%; Power (Watts): 0.1W, 1/10W; Temperature Coefficient: ±100ppm/°C; Supplier 1: Digi-Key; RoHS: RoHS Compliant; Category: Resistors; Stock 1: 2195111; Pricing 1: 1=0.15, 10=0.022, 100=0.009, 1000=0.00403, 2500=0.0035 (AUD); Packaging: Cut Tape (CT); Part Status: Active; Composition: Thick Film; Features: Moisture Resistant; Operating Temperature: -55°C ~ 155°C; Package / Case: 0603 (1608 Metric); Supplier Device Package: 0603; Size / Dimension: 0.063" L x 0.031" W (1.60mm x 0.80mm); Height - Seated (Max): 0.022" (0.55mm); Failure Rate: -; ComponentLink1URL: http://www.yageo.com/documents/recent/PYu-RC_Group_51_RoHS_L_7.pdf; ComponentLink1Description: http://www.yageo.com/documents/recent/PYu-RC_Group_51_RoHS_L_7.pdf; Supplier Part Number 1: 311-120HRCT-ND
R39 R40 R45 R46 = R100_0603: 100 Resistor 0603; Manufacturer: Panasonic Electronic Components; Manufacturer Part Number: ERJ-3EKF1000V; Tolerance: ±1%; Power (Watts): 0.1W, 1/10W; Temperature Coefficient: ±100ppm/°C; Supplier 1: Digi-Key; RoHS: RoHS Compliant; Category: Resistors; Stock 1: 1638281; Pricing 1: 1=0.14, 10=0.026, 25=0.0184, 50=0.0142, 100=0.0105, 250=0.00796, 500=0.00638, 1000=0.0047 (AUD); Packaging: Cut Tape (CT); Part Status: Active; Composition: Thick Film; Features: Automotive AEC-Q200; Operating Temperature: -55°C ~ 155°C; Package / Case: 0603 (1608 Metric); Supplier Device Package: 0603; Size / Dimension: 0.063" L x 0.031" W (1.60mm x 0.80mm); Height - Seated (Max): 0.022" (0.55mm); Failure Rate: -; ComponentLink1URL: https://industrial.panasonic.com/cdbs/www-data/pdf/RDA0000/AOA0000C283.pdf; ComponentLink1Description: https://industrial.panasonic.com/cdbs/www-data/pdf/RDA0000/AOA0000C283.pdf; Supplier Part Number 1: P100HCT-ND
R42 = R4.7k_0603: 4.7k Resistor 0603; Manufacturer: Yageo; Manufacturer Part Number: RC0603FR-074K7L; Tolerance: ±1%; Power (Watts): 0.1W, 1/10W; Temperature Coefficient: ±100ppm/°C; Supplier 1: Digi-Key; RoHS: RoHS Compliant; Category: Resistors; Stock 1: 5834802; Pricing 1: 1=0.15, 10=0.022, 100=0.009, 1000=0.00403, 2500=0.0035 (AUD); Packaging: Cut Tape (CT); Part Status: Active; Composition: Thick Film; Features: Moisture Resistant; Operating Temperature: -55°C ~ 155°C; Package / Case: 0603 (1608 Metric); Supplier Device Package: 0603; Size / Dimension: 0.063" L x 0.031" W (1.60mm x 0.80mm); Height - Seated (Max): 0.022" (0.55mm); Failure Rate: -; ComponentLink1URL: http://www.yageo.com/documents/recent/PYu-RC_Group_51_RoHS_L_7.pdf; ComponentLink1Description: http://www.yageo.com/documents/recent/PYu-RC_Group_51_RoHS_L_7.pdf; Supplier Part Number 1: 311-4.70KHRCT-ND
R43 = R2.61k_0603: 2.61k Resistor 0603; Manufacturer: Yageo; Manufacturer Part Number: RC0603FR-072K61L; Tolerance: ±1%; Power (Watts): 0.1W, 1/10W; Temperature Coefficient: ±100ppm/°C; Supplier 1: Digi-Key; RoHS: RoHS Compliant; Category: Resistors; Stock 1: 104258; Pricing 1: 1=0.15, 10=0.022, 100=0.009, 1000=0.00403, 2500=0.0035 (AUD); Packaging: Cut Tape (CT); Part Status: Active; Composition: Thick Film; Features: Moisture Resistant; Operating Temperature: -55°C ~ 155°C; Package / Case: 0603 (1608 Metric); Supplier Device Package: 0603; Size / Dimension: 0.063" L x 0.031" W (1.60mm x 0.80mm); Height - Seated (Max): 0.022" (0.55mm); Failure Rate: -; ComponentLink1URL: http://www.yageo.com/documents/recent/PYu-RC_Group_51_RoHS_L_7.pdf; ComponentLink1Description: http://www.yageo.com/documents/recent/PYu-RC_Group_51_RoHS_L_7.pdf; Supplier Part Number 1: 311-2.61KHRCT-ND
TEENSY_3.6 = Teensy 3.6: Manufacturer: 3M; Manufacturer Part Number: 929974-01-36-RK; Connector Type: Receptacle; Style: Board to Board; Number of Positions: 36; Number of Positions Loaded: All; Pitch - Mating: 0.100" (2.54mm); Contact Length - Post: 0.125" (3.18mm); Material Flammability Rating: UL94 V-0; Current Rating: 2A; Voltage Rating: 1500V; Supplier 1: Digi-Key; RoHS: RoHS Compliant; Category: Connectors, Interconnects; Stock 1: 7206; Pricing 1: 1=3.64, 10=3.302, 100=2.8305, 500=2.35872, 1000=2.02176, 5000=1.79263 (AUD); Packaging: Bulk; Part Status: Active; Contact Type: Forked; Number of Rows: 1; Row Spacing - Mating: -; Mounting Type: Through Hole; Termination: Solder; Fastening Type: Push-Pull; Contact Finish - Mating: Tin; Contact Finish Thickness - Mating: 100µin (2.54µm); Insulation Color: Black; Insulation Height: 0.325" (8.25mm); Operating Temperature: -40°C ~ 105°C; Contact Finish - Post: Tin; Mated Stacking Heights: -; Ingress Protection: -; Features: -; Applications: -; Insulation Material: Polycyclohexylenedimethylene Terephthalate (PCT), Glass Filled; Contact Shape: Square; Contact Material: Copper Alloy; Contact Finish Thickness - Post: 100µin (2.54µm); ComponentLink1URL: http://multimedia.3m.com/mws/media/22500O/3mtm-boardmount-skt-100-100x-100strt-sldr-tails-ts0815.pdf?&fn=ts0815.pdf; ComponentLink1Description: http://multimedia.3m.com/mws/media/22500O/3mtm-boardmount-skt-100-100x-100strt-sldr-tails-ts0815.pdf?&fn=ts0815.pdf; Supplier Part Number 1: 929974E-01-36-ND
U1 = OPA4342EA/250: Manufacturer: Texas Instruments; Bandwidth: 1MHz; Max Supply Voltage: 5.5V; Min Supply Voltage: 2.7V; Voltage Gain: 124dB; Nominal Supply Current: 1mA; Common Mode Rejection Ratio: 76dB; Number of Channels: 4; Slew Rate: 1V/µs; Max I/O Voltage: 6mV; Input Bias Current: 10pA; Power Supply Rejection Ratio (PSRR): 90.46dB; Supplier 1: Digi-Key; Manufacturer Part Number: OPA4342EA/250; Stock 1: 233; Pricing 1: 1=2.83, 10=2.544, 100=2.0447 (USD); Case/Package: TSSOP; Number of Pins: 14; Min Operating Temperature: -40°C; Max Operating Temperature: 85°C; Packaging: Tape and Reel; Unity Gain Bandwidth Product: 1MHz; Package Quantity: 250; Nominal Gain Bandwidth Product: 1MHz; Number of Circuits: 4; Input Offset Voltage (Vos): 6mV; Gain Bandwidth Product: 1MHz; Number of Amplifiers: 4; Number of Elements: 4; Radiation Hardening: No; REACH SVHC: No SVHC; Lead Free: Lead Free; ComponentLink1URL: https://datasheet.ciiva.com/26226/sbos106a-26226441.pdf; ComponentLink1Description: https://datasheet.ciiva.com/26226/sbos106a-26226441.pdf; ComponentLink2URL: https://datasheet.ciiva.com/1798/opa4342-1798587.pdf; ComponentLink2Description: https://datasheet.ciiva.com/1798/opa4342-1798587.pdf; ComponentLink3URL: https://datasheet.ciiva.com/7684/53610-7684523.pdf; ComponentLink3Description: https://datasheet.ciiva.com/7684/53610-7684523.pdf; ComponentLink4URL: https://datasheet.ciiva.com/14458/sbos106a-14458539.pdf; ComponentLink4Description: https://datasheet.ciiva.com/14458/sbos106a-14458539.pdf; ComponentLink5URL: https://datasheet.ciiva.com/1798/opa4342-1798588.pdf; ComponentLink5Description: https://datasheet.ciiva.com/1798/opa4342-1798588.pdf; ComponentLink6URL: https://datasheet.ciiva.com/2974/sbos106a-2974060.pdf; ComponentLink6Description: https://datasheet.ciiva.com/2974/sbos106a-2974060.pdf; ComponentLink7URL: https://datasheet.ciiva.com/1798/opa4342-1798589.pdf; ComponentLink7Description: https://datasheet.ciiva.com/1798/opa4342-1798589.pdf; ComponentLink8URL: https://datasheet.ciiva.com/48711/001072822-da-01-en-ic-opamp-gp-r-opa4342ea-250-tssop-14-tid-48711451.pdf; ComponentLink8Description: https://datasheet.ciiva.com/48711/001072822-da-01-en-ic-opamp-gp-r-opa4342ea-250-tssop-14-tid-48711451.pdf; Supplier Part Number 1: OPA4342EADKR-ND
U2 U4 = CAN Transceiver 3.3V: Manufacturer: Texas Instruments; Manufacturer Part Number: SN65HVD230DR; Number of Drivers/Receivers: 1/1; Duplex: Half; Data Rate: 1Mbps; Voltage - Supply: 3 V ~ 3.6 V; Supplier 1: Digi-Key; RoHS: RoHS Compliant; Category: Integrated Circuits (ICs); Stock 1: 41612; Pricing 1: 1=3.01, 10=2.698, 100=2.1685, 500=1.78162, 1000=1.4762 (AUD); Packaging: Cut Tape (CT); Part Status: Active; Type: Transceiver; Protocol: CAN; Operating Temperature: -40°C ~ 85°C; Mounting Type: Surface Mount; Package / Case: 8-SOIC (0.154", 3.90mm Width); Supplier Device Package: 8-SOIC; ComponentLink1URL: http://www.ti.com/lit/ds/symlink/sn65hvd230.pdf; ComponentLink1Description: http://www.ti.com/lit/ds/symlink/sn65hvd230.pdf; Supplier Part Number 1: 296-11654-1-ND
U3 = Xbee Pro: Manufacturer: Samtec Inc.; Manufacturer Part Number: MMS-110-01-L-SV; Connector Type: Receptacle; Style: Board to Board or Cable; Number of Positions: 10; Number of Positions Loaded: All; Pitch - Mating: 0.079" (2.00mm); Contact Length - Post: 0.115" (2.92mm); Current Rating: 3.9A per Contact; Supplier 1: Digi-Key; RoHS: RoHS Compliant; Category: Connectors, Interconnects; Stock 1: 605; Pricing 1: 1=6.2, 10=5.369, 100=4.5428, 500=3.61358, 1000=2.94247, 5000=2.68436, 10000=2.58112 (AUD); Packaging: Tube; Part Status: Active; Contact Type: Female Socket; Number of Rows: 1; Row Spacing - Mating: -; Mounting Type: Through Hole; Termination: Solder; Fastening Type: Push-Pull; Contact Finish - Mating: Gold; Contact Finish Thickness - Mating: 10µin (0.25µm); Insulation Color: Black; Insulation Height: 0.175" (4.45mm); Operating Temperature: -55°C ~ 125°C; Material Flammability Rating: -; Contact Finish - Post: Tin; Mated Stacking Heights: -; Ingress Protection: -; Features: -; Voltage Rating: -; Applications: -; Insulation Material: Liquid Crystal Polymer (LCP); Contact Shape: Square; Contact Material: Phosphor Bronze; Contact Finish Thickness - Post: -; ComponentLink1URL: http://suddendocs.samtec.com/prints/mms01mkt.pdf; ComponentLink1Description: http://suddendocs.samtec.com/prints/mms01mkt.pdf; Supplier Part Number 1: SAM1230-10-ND
U5 = 5V 1A LDO Regulator NCP1117: Manufacturer: ON Semiconductor; Manufacturer Part Number: NCP1117ST50T3G; Regulator Topology: Positive Fixed; Voltage - Dropout (Typical): 1.07V @ 800mA; Voltage - Input: Up to 20V; Supplier 1: Digi-Key; RoHS: RoHS Compliant; Category: Integrated Circuits (ICs); Stock 1: 36810; Pricing 1: 1=0.7, 10=0.604, 100=0.4508, 500=0.35418, 1000=0.27368 (AUD); Packaging: Cut Tape (CT); Part Status: Active; Voltage - Output: 5V; Current - Output: 1A; Current - Limit (Min): 1A; Operating Temperature: 0°C ~ 125°C; Mounting Type: Surface Mount; Package / Case: TO-261-4, TO-261AA; Supplier Device Package: SOT-223; ComponentLink1URL: http://www.onsemi.com/pub_link/Collateral/NCP1117-D.PDF; ComponentLink1Description: http://www.onsemi.com/pub_link/Collateral/NCP1117-D.PDF; Supplier Part Number 1: NCP1117ST50T3GOSCT-ND